# EAGLE design hauptplatine (EAGLE 4.09)
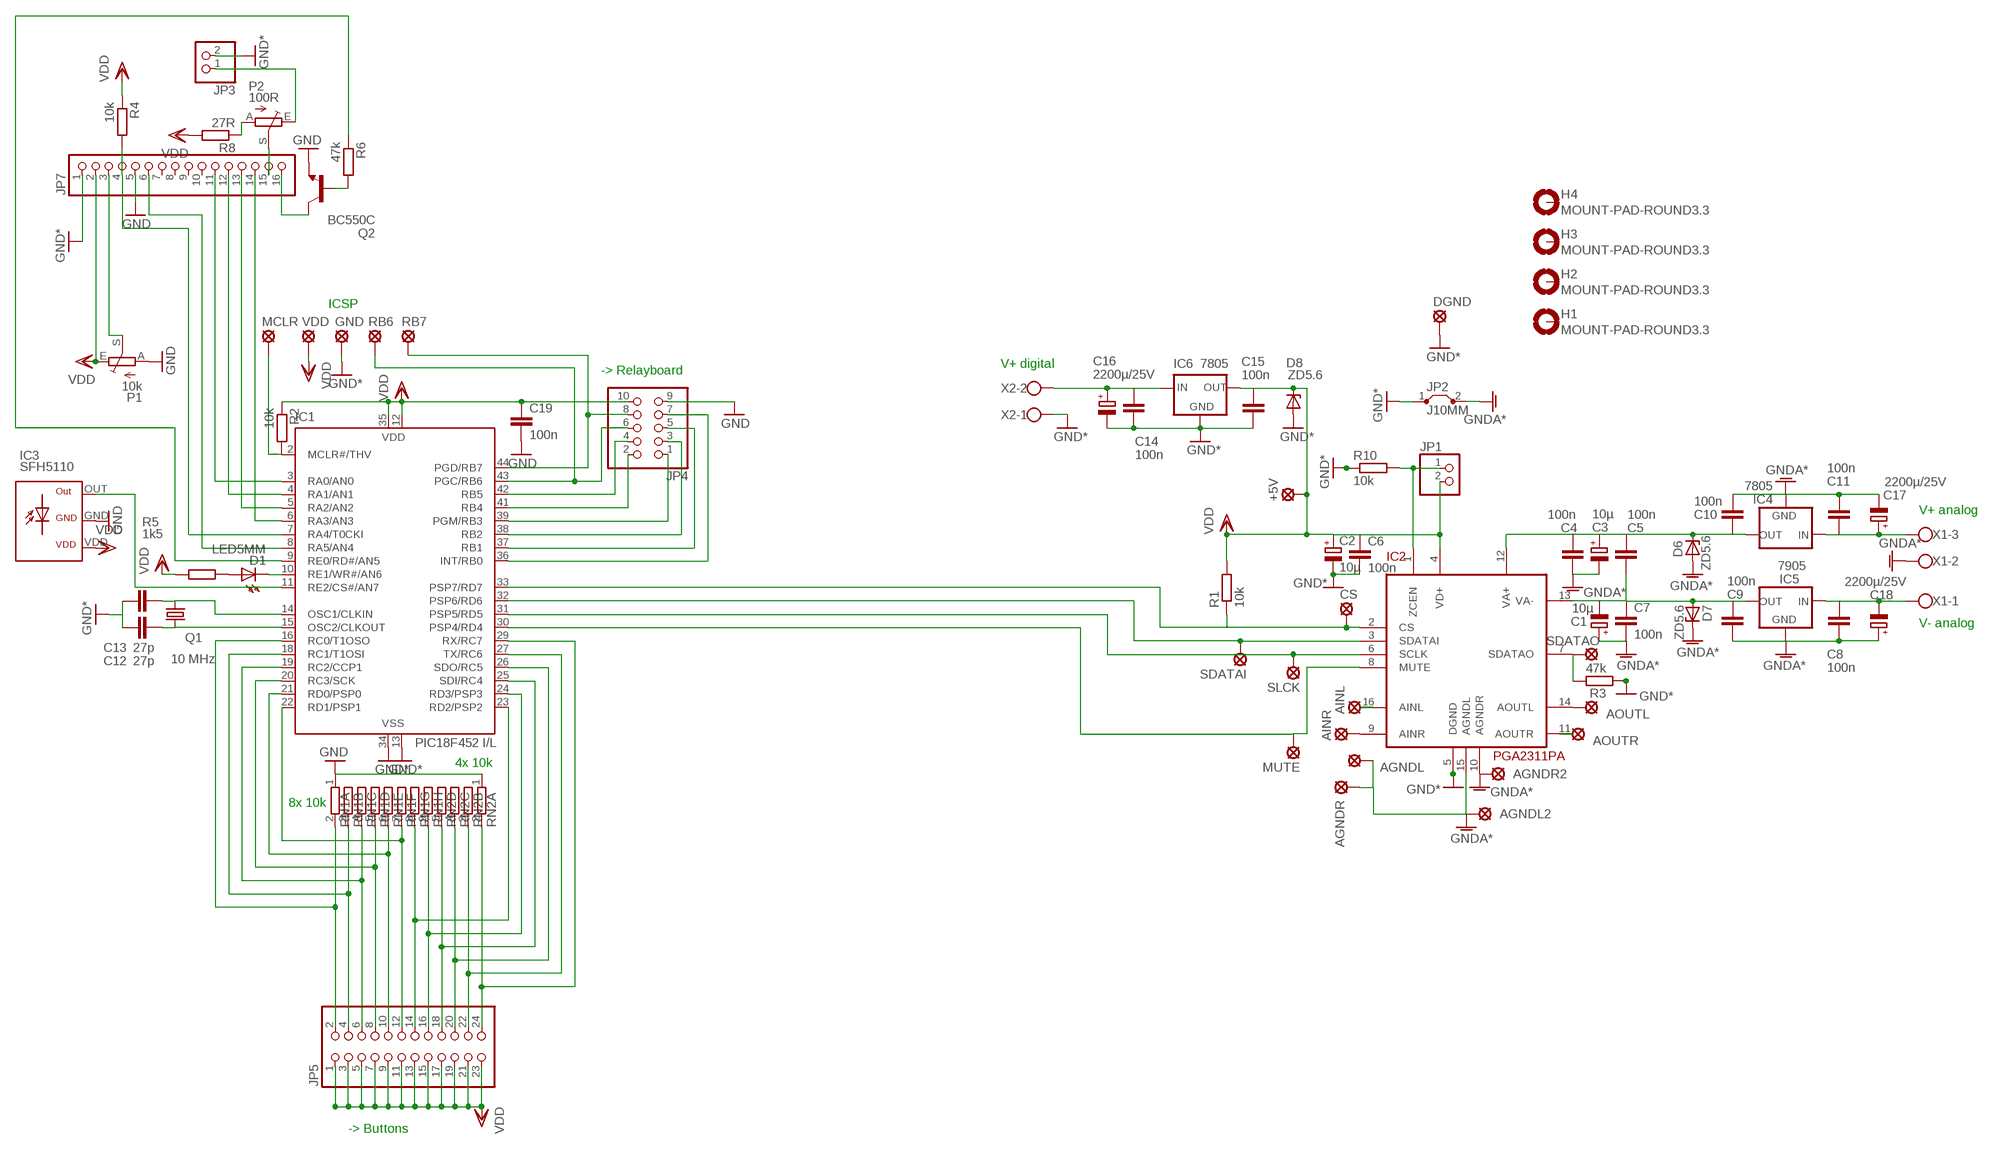
[diagram p0: schematic, sheet 1]

## Parts
+5V  LSP10  [LSP10]
AGNDL  LSP10  [LSP10]
AGNDL2  LSP10  [LSP10]
AGNDR  LSP10  [LSP10]
AGNDR2  LSP10  [LSP10]
AINL  LSP10  [LSP10]
AINR  LSP10  [LSP10]
AOUTL  LSP10  [LSP10]
AOUTR  LSP10  [LSP10]
C1  10µ  CPOL-EUE2-5  [E2-5]
C2  10µ  CPOL-EUE2-5  [E2-5]
C3  10µ  CPOL-EUE2-5  [E2-5]
C4  100n  C-EU050-025X075  [C050-025X075]
C5  100n  C-EU025-025X050  [C025-025X050]
C6  100n  C-EU025-025X050  [C025-025X050]
C7  100n  C-EU050-025X075  [C050-025X075]
C8  100n  C-EU050-025X075  [C050-025X075]
C9  100n  C-EU050-025X075  [C050-025X075]
C10  100n  C-EU050-025X075  [C050-025X075]
C11  100n  C-EU050-025X075  [C050-025X075]
C12  27p  C-EU025-024X044  [C025-024X044]
C13  27p  C-EU025-024X044  [C025-024X044]
C14  100n  C-EU050-025X075  [C050-025X075]
C15  100n  C-EU050-025X075  [C050-025X075]
C16  2200µ/25V  CPOL-EUE7.5-16  [E7,5-16]
C17  2200µ/25V  CPOL-EUE7.5-16  [E7,5-16]
C18  2200µ/25V  CPOL-EUE7.5-16  [E7,5-16]
C19  100n  C-EU025-025X050  [C025-025X050]
CS  LSP10  [LSP10]
D1  LED5MM  [LED5MM]
D6  ZD5.6  ZENER-DIODEZD-5  [ZDIO-5]
D7  ZD5.6  ZENER-DIODEZD-5  [ZDIO-5]
D8  ZD5.6  ZENER-DIODEZD-5  [ZDIO-5]
DGND  LSP10  [LSP10]
GND  LSP11  [LSP11]
H1  MOUNT-PAD-ROUND3.3  [3,3-PAD]
H2  MOUNT-PAD-ROUND3.3  [3,3-PAD]
H3  MOUNT-PAD-ROUND3.3  [3,3-PAD]
H4  MOUNT-PAD-ROUND3.3  [3,3-PAD]
IC1  PIC18F452 I/L  PIC16F87BEN  [PLCC44S_PIN]
IC2  PGA2311PA  CS3310-KP"  [DIP-16]
IC3  SFH5110  [SFH5110]
IC4  7805  78XXS  [78XXS]
IC5  7905  79XXS  [79XXS]
IC6  7805  78XXS  [78XXS]
JP1  PINHD-1X2  [1X02]
JP2  J10MM  [10]
JP3  PINHD-1X2  [1X02]
JP4  PINHD-2X5  [2X05]
JP5  PINHD-2X12  [2X12]
JP7  PINHD-1X16  [1X16]
MCLR  LSP11  [LSP11]
MUTE  LSP10  [LSP10]
P1  10k  TRIM_EU-LI10  [LI10]
P2  100R  TRIM_EU-LI10  [LI10]
Q1  10 MHz  HC18U-V  [HC18U-V]
Q2  BC550C  [TO92-EBC]
R1  10k  R-EU_0207/7  [0207/7]
R2  10k  R-EU_0207/10  [0207/10]
R3  47k  R-EU_0207/10  [0207/10]
R4  10k  R-EU_0207/7  [0207/7]
R5  1k5  R-EU_0207/2V  [0207/2V]
R6  47k  R-EU_0207/10  [0207/10]
R8  27R  R-EU_0207/7  [0207/7]
R10  10k  R-EU_0207/7  [0207/7]
RB6  LSP11  [LSP11]
RB7  LSP11  [LSP11]
RN1  GE08R  [SIL9]
RN2  GE04R  [SIL5]
SDATAI  LSP10  [LSP10]
SDATAO  LSP10  [LSP10]
SLCK  LSP10  [LSP10]
VDD  LSP11  [LSP11]
X1  W237-103  [W237-103]
X2  W237-102  [W237-102]

## Nets
AOUTR: AOUTR.MP IC2.11(AOUTR)
BUTTON1: IC1.16(RC0/T1OSO) JP5.2 RN1.2
BUTTON2: IC1.18(RC1/T1OSI) JP5.4 RN1.3
BUTTON3: IC1.19(RC2/CCP1) JP5.6 RN1.4
BUTTON4: IC1.20(RC3/SCK) JP5.8 RN1.5
BUTTON5: IC1.21(RD0/PSP0) JP5.10 RN1.6
BUTTON6: IC1.22(RD1/PSP1) JP5.12 RN1.7
BUTTON7: IC1.23(RD2/PSP2) JP5.14 RN1.8
BUTTON8: IC1.24(RD3/PSP3) JP5.16 RN1.9
CONT: JP7.3 P1.S
CS: CS.MP IC1.33(PSP7/RD7) IC2.2(CS) R1.1
D4: IC1.3(RA0/AN0) JP7.11
D5: IC1.4(RA1/AN1) JP7.12
D6: IC1.5(RA2/AN2) JP7.13
D7: IC1.6(RA3/AN3) JP7.14
D/I: IC1.7(RA4/T0CKI) JP7.4 R4.2
DOWN: IC1.25(SDI/RC4) JP5.18 RN2.5
E: IC1.8(RA5/AN4) JP7.6
E0: IC1.9(RE0/RD#/AN5) R6.1
GND: C2.- C6.1 C12.2 C13.2 C14.1 C15.1 C16.- C19.1 D8.A DGND.MP GND.MP IC1.13(VSS) IC1.34(VSS) IC2.5(DGND) IC3.GND IC6.GND JP2.1 JP3.2 JP4.9 JP7.1 JP7.5 P1.A Q2.E R3.1 R10.1 RN1.1 RN2.1 X2.1 ; supply symbol labelled GND*
GNDA: AGNDL2.MP AGNDL.MP AGNDR2.MP AGNDR.MP C1.+ C3.- C4.1 C7.1 C8.1 C9.1 C10.2 C11.2 C17.- C18.+ D6.A D7.C IC2.10(AGNDR) IC2.15(AGNDL) IC4.GND IC5.GND JP2.2 X1.2 ; supply symbol labelled GNDA*
IR_IN: IC1.11(RE2/CS#/AN7) IC3.OUT
LED: D1.K(C) IC1.10(RE1/WR#/AN6)
LEFT: IC1.27(TX/RC6) JP5.22 RN2.3
MUTE: IC1.30(PSP4/RD4) IC2.8(MUTE) MUTE.MP
N$1: AOUTL.MP IC2.14(AOUTL)
N$2: C8.2 C18.- IC5.IN X1.1
N$3: JP7.16 Q2.C
N$5: AINR.MP IC2.9(AINR)
N$6: AINL.MP IC2.16(AINL)
N$10: C11.1 C17.+ IC4.IN X1.3
N$11: IC1.2(MCLR#/THV) MCLR.MP R2.2
N$13: Q2.B R6.2
N$14: D1.A R5.2
N$17: IC2.1(ZCEN) JP1.1 R10.2
N$22: C14.2 C16.+ IC6.IN X2.2
N$25: P2.A R8.1
N$26: JP3.1 P2.E
N$27: JP7.15 P2.S
OSC1: C12.1 IC1.14(OSC1/CLKIN) Q1.2
OSC2: C13.1 IC1.15(OSC2/CLKOUT) Q1.1
RELAYS1: IC1.36(INT/RB0) JP4.7
RELAYS2: IC1.37(RB1) JP4.5
RELAYS3: IC1.38(RB2) JP4.3
RELAYS4: IC1.39(PGM/RB3) JP4.1
RELAYS5: IC1.41(RB4) JP4.2
RELAYS6: IC1.42(RB5) JP4.4
RELAYS7: IC1.43(PGC/RB6) JP4.6 RB6.MP
RELAYS8: IC1.44(PGD/RB7) JP4.8 RB7.MP
RIGHT: IC1.29(RX/RC7) JP5.24 RN2.2
SDATAI: IC1.32(PSP6/RD6) IC2.3(SDATAI) SDATAI.MP
SDATAO: IC2.7(SDATAO) R3.2 SDATAO.MP
SLCK: IC1.31(PSP5/RD5) IC2.6(SCLK) SLCK.MP
UP: IC1.26(SDO/RC5) JP5.20 RN2.4
VA+: C3.+ C4.2 C5.2 C10.1 D6.C IC2.12(VA+) IC4.OUT
VA-: C1.- C5.1 C7.2 C9.2 D7.A IC2.13(VA-) IC5.OUT
VDD: +5V.MP C2.+ C6.2 C15.2 C19.2 D8.C IC1.12(VDD) IC1.35(VDD) IC2.4(VD+) IC3.VDD IC6.OUT JP1.2 JP4.10 JP5.1 JP5.3 JP5.5 JP5.7 JP5.9 JP5.11 JP5.13 JP5.15 JP5.17 JP5.19 JP5.21 JP5.23 JP7.2 P1.E R1.2 R2.1 R4.1 R5.1 R8.2 VDD.MP
Unconnected: H1.B3,3(MOUNT) H2.B3,3(MOUNT) H3.B3,3(MOUNT) H4.B3,3(MOUNT) JP7.7 JP7.8 JP7.9 JP7.10

## Notes on the sheet
- ICSP
- V+ digital
- -> Relayboard
- V+ analog
- V- analog
- 4x 10k
- 8x 10k
- -> Buttons

## Library data of the parts
+5V AGNDL AGNDL2 AGNDR AGNDR2 AINL AINR AOUTL AOUTR CS DGND MUTE SDATAI SDATAO SLCK = solpad:LSP10: SOLDER PAD drill 1.0 mm, distributor Buerklin, 12H555
C1-C3 C16-C18 = rcl:CPOL-EU: POLARIZED CAPACITOR, European symbol
C4-C15 C19 = rcl:C-EU: CAPACITOR, European symbol
D1 = led:LED5MM: LED 5 mm, round
D6-D8 = diode:ZENER-DIODE: Z-Diode
GND MCLR RB6 RB7 VDD = solpad:LSP11: SOLDER PAD drill 1.1 mm
H1-H4 = holes:MOUNT-PAD-ROUND: MOUNTING PAD, round
IC1 = microchip:PIC16F87*: MICROCONTROLLER
IC2 = crystal-semi:CS3310-KP
IC3 = ben:SFH5110
IC4 IC6 = v-reg:78XXS: VOLTAGE REGULATOR
IC5 = v-reg:79XXS: VOLTAGE REGULATOR
JP1 JP3 = pinhead:PINHD-1X2: PIN HEADER
JP2 = jumper:J: Bridge
JP4 = pinhead:PINHD-2X5: PIN HEADER
JP5 = pinhead:PINHD-2X12: PIN HEADER
JP7 = pinhead:PINHD-1X16: PIN HEADER
P1 P2 = pot:TRIM_EU-: POTENTIOMETER
Q1 = crystal:HC18U-V: CRYSTAL
Q2 = transistor-npn:BC550*: NPN Transistor
R1-R6 R8 R10 = rcl:R-EU_: RESISTOR, European symbol
RN1 = resistor-sil:GE08R: SIL RESISTOR
RN2 = resistor-sil:GE04R: SIL RESISTOR
X1 = con-wago-500:W237-103: WAGO SCREW CLAMP
X2 = con-wago-500:W237-102: WAGO SCREW CLAMP

## Board
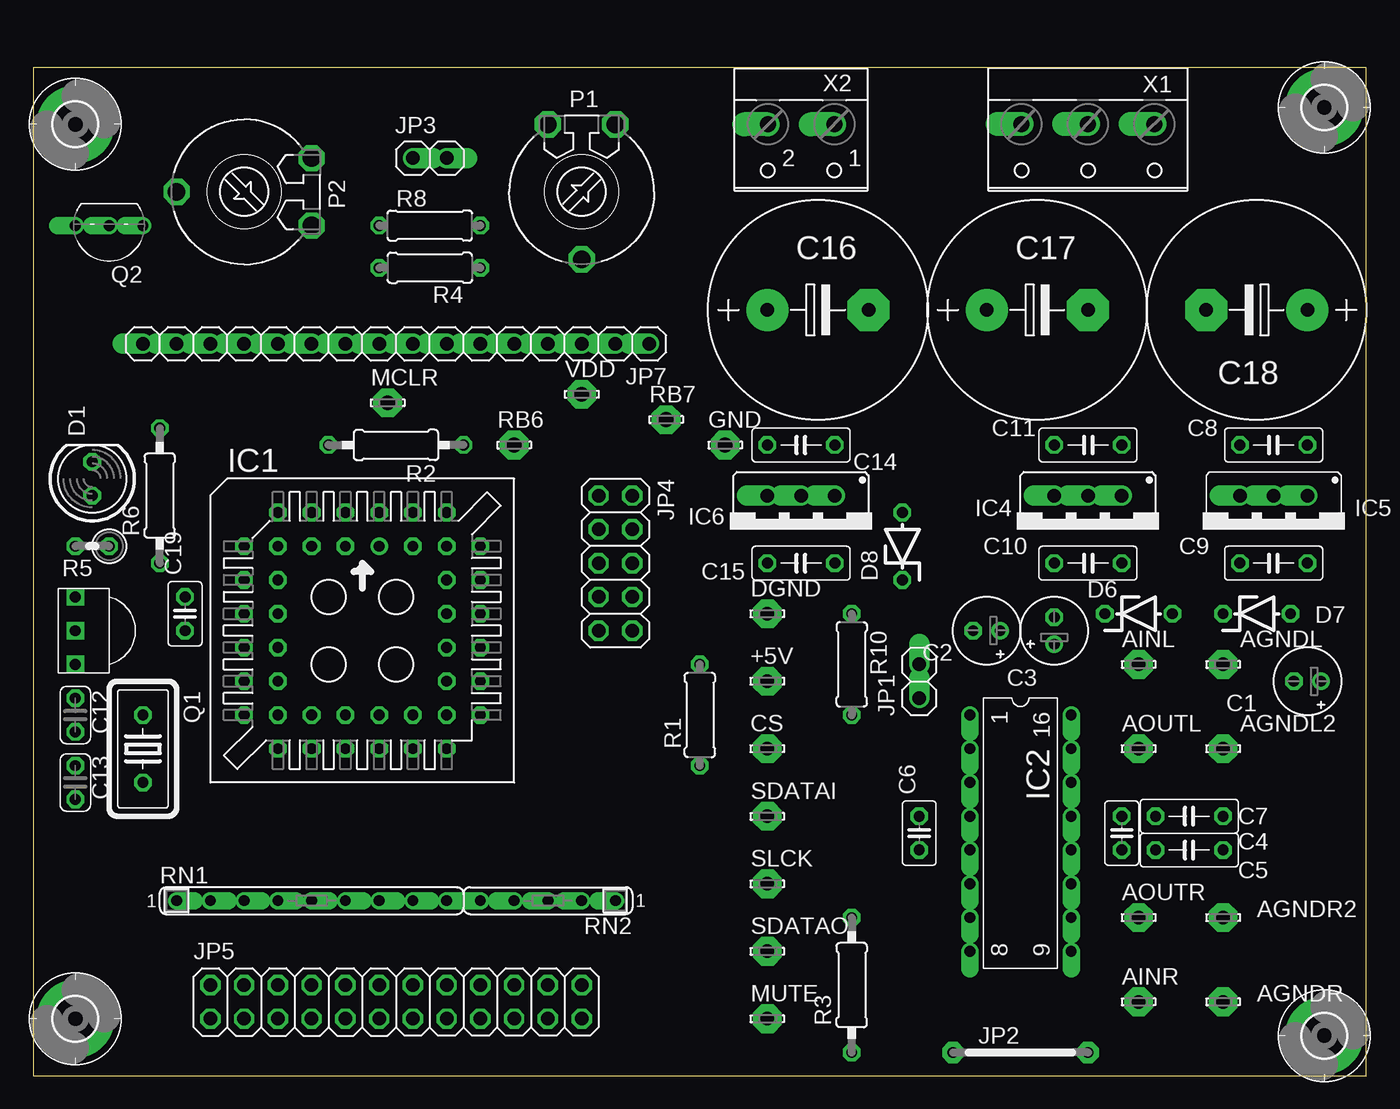
[diagram p1: board, top side]
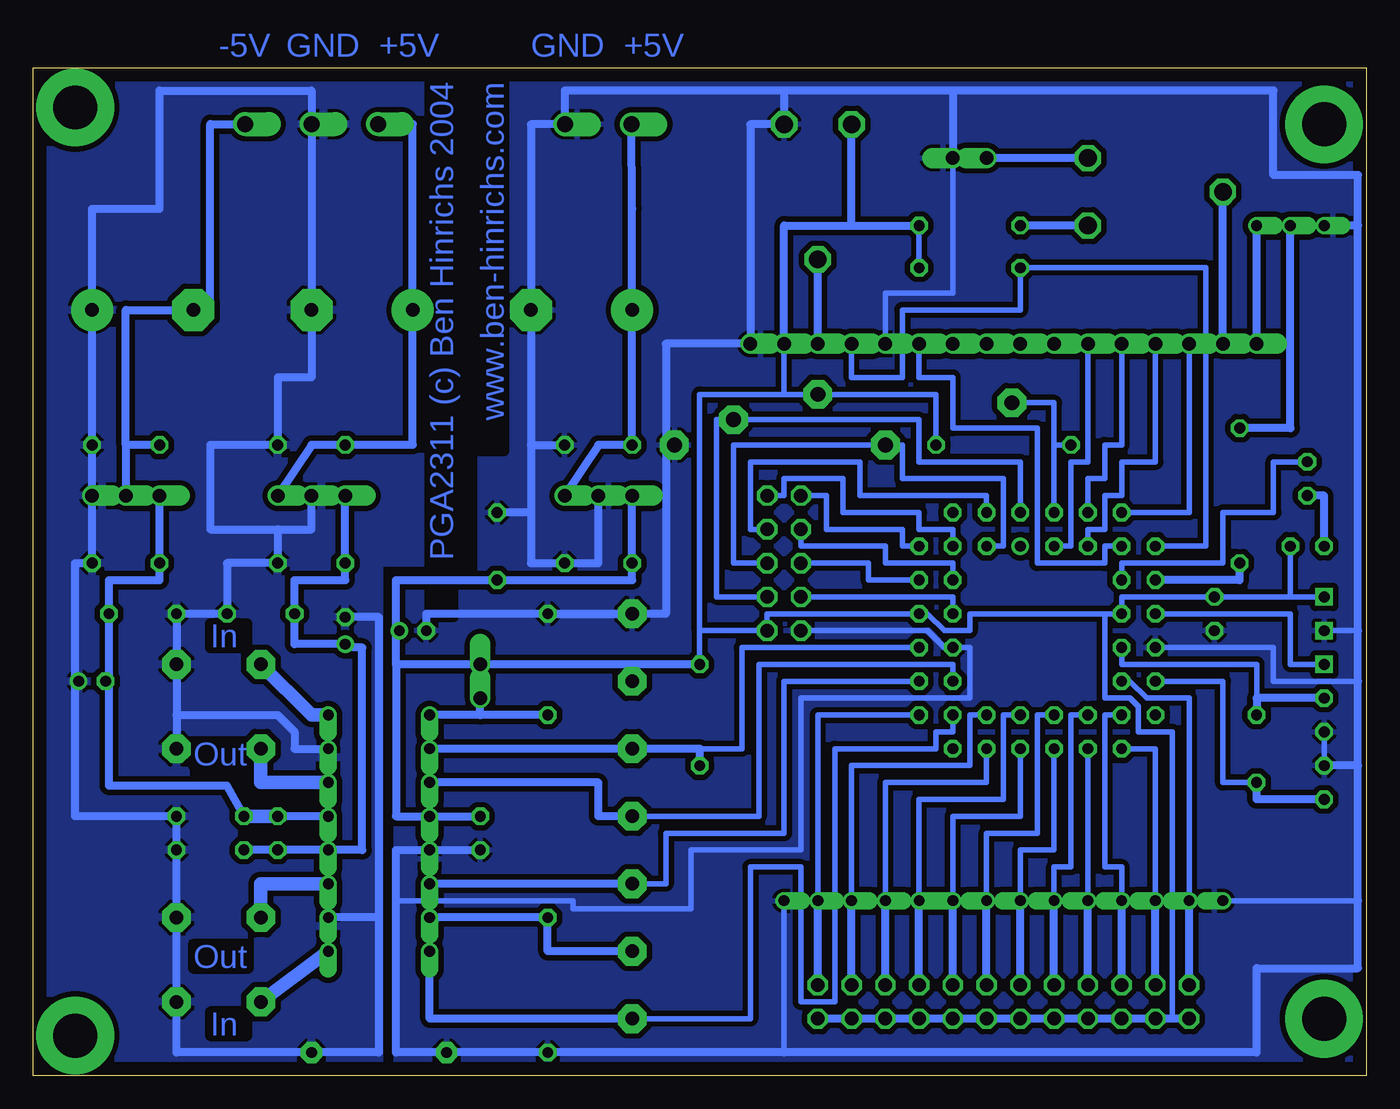
[diagram p2: board, bottom side, seen from below]

Size 100.31 x 75.87 mm. Coordinates in mm from the lower left corner, seen from the top.
Outline: 0,0 100.31,0 100.31,75.87 0,75.87 0,0
Copper layers used: Bottom

### Footprints (pad centres in the part's own frame; a part is rotated, then mirrored left to right if it is on the bottom)
LSP10 = drill 1.016 pad 2.159 octagon: MP 0,0
E2-5 = drill 0.813 pad 1.27 round: + -1.016,0 | drill 0.813 pad 1.27 octagon: - 1.016,0
C050-025X075 = drill 0.813 octagon: 1 -2.54,0; 2 2.54,0
C025-025X050 = drill 0.813 octagon: 1 -1.27,0; 2 1.27,0
C025-024X044 = drill 0.813 octagon: 1 -1.27,0; 2 1.27,0
E7,5-16 = drill 1.016 pad 3.15 round: + -3.81,0 | drill 1.016 pad 3.15 octagon: - 3.81,0
LED5MM = drill 0.813 octagon: A -1.27,0; K 1.27,0
ZDIO-5 = drill 0.813 octagon: A 2.54,0; C -2.54,0
LSP11 = drill 1.118 pad 2.159 octagon: MP 0,0
3,3-PAD = drill 3.3 pad 5.842 round: B3,3 0,0
PLCC44S_PIN = drill 0.813 round: 1 1.27,6.35 | drill 0.813 octagon: 2 -1.27,8.89; 3 -1.27,6.35; 4 -3.81,8.89; 5 -3.81,6.35; 6 -6.35,8.89; 7 -8.89,6.35; 8 -6.35,6.35; 9 -8.89,3.81; 10 -6.35,3.81; 11 -8.89,1.27; 12 -6.35,1.27; 13 -8.89,-1.27; 14 -6.35,-1.27; 15 -8.89,-3.81; 16 -6.35,-3.81; 17 -8.89,-6.35; 18 -6.35,-8.89; 19 -6.35,-6.35; 20 -3.81,-8.89; 21 -3.81,-6.35; 22 -1.27,-8.89; 23 -1.27,-6.35; 24 1.27,-8.89; 25 1.27,-6.35; 26 3.81,-8.89; 27 3.81,-6.35; 28 6.35,-8.89; 29 8.89,-6.35; 30 6.35,-6.35; 31 8.89,-3.81; 32 6.35,-3.81; 33 8.89,-1.27; 34 6.35,-1.27; 35 8.89,1.27; 36 6.35,1.27; 37 8.89,3.81; 38 6.35,3.81; 39 8.89,6.35; 40 6.35,8.89; 41 6.35,6.35; 42 3.81,8.89; 43 3.81,6.35; 44 1.27,8.89
DIP-16 = drill 0.813 offset: 1 -8.89,-3.81; 2 -6.35,-3.81; 3 -3.81,-3.81; 4 -1.27,-3.81; 5 1.27,-3.81; 6 3.81,-3.81; 7 6.35,-3.81; 8 8.89,-3.81; 9 8.89,3.81; 10 6.35,3.81; 11 3.81,3.81; 12 1.27,3.81; 13 -1.27,3.81; 14 -3.81,3.81; 15 -6.35,3.81; 16 -8.89,3.81
SFH5110 = drill 0.813 square: GND 0,1.27; OUT -2.54,1.27; VDD 2.54,1.27
78XXS = drill 1.016 offset: GND 0,-2.54; IN -2.54,-2.54; OUT 2.54,-2.54
79XXS = drill 1.016 offset: GND -2.54,-2.54; IN 0,-2.54; OUT 2.54,-2.54
1X02 = drill 1.016 offset: 1 -1.27,0; 2 1.27,0
10 = drill 0.813 pad 1.6 octagon: 1 -5.08,0; 2 5.08,0
2X05 = drill 1.016 octagon: 1 -5.08,-1.27; 2 -5.08,1.27; 3 -2.54,-1.27; 4 -2.54,1.27; 5 0,-1.27; 6 0,1.27; 7 2.54,-1.27; 8 2.54,1.27; 9 5.08,-1.27; 10 5.08,1.27
2X12 = drill 1.016 octagon: 1 -13.97,-1.27; 2 -13.97,1.27; 3 -11.43,-1.27; 4 -11.43,1.27; 5 -8.89,-1.27; 6 -8.89,1.27; 7 -6.35,-1.27; 8 -6.35,1.27; 9 -3.81,-1.27; 10 -3.81,1.27; 11 -1.27,-1.27; 12 -1.27,1.27; 13 1.27,-1.27; 14 1.27,1.27; 15 3.81,-1.27; 16 3.81,1.27; 17 6.35,-1.27; 18 6.35,1.27; 19 8.89,-1.27; 20 8.89,1.27; 21 11.43,-1.27; 22 11.43,1.27; 23 13.97,-1.27; 24 13.97,1.27
1X16 = drill 1.016 offset: 1 -19.05,0; 2 -16.51,0; 3 -13.97,0; 4 -11.43,0; 5 -8.89,0; 6 -6.35,0; 7 -3.81,0; 8 -1.27,0; 9 1.27,0; 10 3.81,0; 11 6.35,0; 12 8.89,0; 13 11.43,0; 14 13.97,0; 15 16.51,0; 16 19.05,0
LI10 = drill 1.321 octagon: A -2.54,-5.08; E 2.54,-5.08; S 0,5.08
HC18U-V = drill 0.813 octagon: 1 -2.54,0; 2 2.54,0
TO92-EBC = drill 0.813 offset: B 0,-1.27; C -2.54,-1.27; E 2.54,-1.27
0207/7 = drill 0.813 octagon: 1 -3.81,0; 2 3.81,0
0207/10 = drill 0.813 octagon: 1 -5.08,0; 2 5.08,0
0207/2V = drill 0.813 octagon: 1 -1.27,0; 2 1.27,0
SIL9 = drill 0.813 offset: 1 -10.16,0; 2 -7.62,0; 3 -5.08,0; 4 -2.54,0; 5 0,0; 6 2.54,0; 7 5.08,0; 8 7.62,0; 9 10.16,0
SIL5 = drill 0.813 offset: 1 -5.08,0; 2 -2.54,0; 3 0,0; 4 2.54,0; 5 5.08,0
W237-103 = drill 1.194 offset: 1 -5,-1.29; 2 0,-1.29; 3 5,-1.29
W237-102 = drill 1.194 offset: 1 -2.5,-1.27; 2 2.5,-1.27

### Placement (x,y rotation side)
+5V  55.24,29.68 0 top
AGNDL  89.53,30.95 0 top
AGNDL2  89.53,24.6 0 top
AGNDR  89.53,5.55 0 top
AGNDR2  89.53,11.9 0 top
AINL  83.18,30.95 0 top
AINR  83.18,5.55 0 top
AOUTL  83.18,24.6 0 top
AOUTR  83.18,11.9 0 top
C1  95.88,29.68 180 top
C2  71.75,33.49 180 top
C3  76.83,33.49 90 top
C4  86.99,16.98 180 top
C5  81.91,18.25 270 top
C6  66.67,18.25 90 top
C7  86.99,19.52 180 top
C8  93.34,47.46 180 top
C9  93.34,38.57 180 top
C10  79.37,38.57 0 top
C11  79.37,47.46 0 top
C12  3.17,27.14 270 top
C13  3.17,22.06 90 top
C14  57.78,47.46 180 top
C15  57.78,38.57 180 top
C16  59.05,57.62 0 top
C17  75.56,57.62 0 top
C18  92.07,57.62 180 top
C19  11.43,34.76 90 top
CS  55.24,24.6 0 top
D1  4.44,44.92 90 top
D6  83.18,34.76 0 top
D7  92.07,34.76 0 top
D8  65.4,39.84 90 top
DGND  55.24,34.76 0 top
GND  52.07,47.46 0 top
H1  3.17,71.59 0 top
H2  3.17,4.28 0 top
H3  97.15,3.01 0 top
H4  97.15,72.86 0 top
IC1  24.76,33.49 0 top
IC2  74.29,18.25 270 top
IC3  4.44,33.49 90 top
IC4  79.37,41.11 180 top
IC5  93.34,41.11 180 top
IC6  57.78,41.11 180 top
JP1  66.67,29.68 90 top
JP2  74.29,1.74 0 top
JP3  29.84,69.05 0 top
JP4  43.81,38.57 270 top
JP5  27.3,5.55 0 top
JP7  27.3,55.08 180 top
MCLR  26.66,50.63 0 top
MUTE  55.24,4.28 0 top
P1  41.27,66.51 180 top
P2  15.87,66.51 90 top
Q1  8.25,24.6 90 top
Q2  5.71,62.7 180 top
R1  50.16,27.14 90 top
R2  27.3,47.46 180 top
R3  61.59,6.82 90 top
R4  29.84,60.8 180 top
R5  4.44,39.84 180 top
R6  9.52,43.65 90 top
R8  29.84,63.97 0 top
R10  61.59,30.95 270 top
RB6  36.19,47.46 0 top
RB7  47.62,49.37 0 top
RN1  20.95,13.17 0 top
RN2  38.73,13.17 180 top
SDATAI  55.24,19.52 0 top
SDATAO  55.24,9.36 0 top
SLCK  55.24,14.44 0 top
VDD  41.27,51.27 0 top
X1  79.37,70.32 180 top
X2  57.78,70.32 180 top

### Tracks (layer width: path | path; a pad name or v marks a point on that pad's centre or on a via)
AOUTR
  Bottom 1.016: IC2.11 83.18,14.44 AOUTR.MP
BUTTON1
  Bottom 0.406: RN1.2 13.33,28.41 16.5,28.41 17.77,29.68 IC1.16
  Bottom 0.61: JP5.2 RN1.2
BUTTON2
  Bottom 0.406: IC1.18 15.87,24.6 RN1.3
  Bottom 0.61: JP5.4 RN1.3
BUTTON3
  Bottom 0.406: IC1.19 19.68,27.14 19.68,15.71 18.41,15.71 RN1.4
  Bottom 0.61: JP5.6 RN1.4
BUTTON4
  Bottom 0.406: RN1.5 IC1.20
  Bottom 0.61: JP5.8 RN1.5
BUTTON5
  Bottom 0.406: IC1.21 22.22,27.14 22.22,15.71 23.49,15.71 RN1.6
  Bottom 0.61: JP5.10 RN1.6
BUTTON6
  Bottom 0.406: IC1.22 23.49,16.98 26.03,16.98 RN1.7
  Bottom 0.61: JP5.12 RN1.7
BUTTON7
  Bottom 0.406: IC1.23 24.76,27.14 24.76,18.25 28.57,18.25 RN1.8
  Bottom 0.61: JP5.14 RN1.8
BUTTON8
  Bottom 0.406: IC1.24 26.03,19.52 31.11,19.52 RN1.9
  Bottom 0.61: JP5.16 RN1.9
CONT
  Bottom 0.61: JP7.3 P1.S
CS
  Bottom 0.406: 50.16,24.6 46.98,24.6 46.98,32.22 IC1.33
  Bottom 0.61: CS.MP 50.16,24.6 R1.1 | CS.MP IC2.2 CS.MP
D4
  Bottom 0.406: IC1.3 22.22,39.84 22.22,46.19 20.95,46.19 JP7.11
D5
  Bottom 0.406: IC1.4 20.95,44.92 19.68,44.92 19.68,47.46 18.41,47.46 JP7.12
D6
  Bottom 0.406: IC1.5 20.95,41.11 19.68,41.11 19.68,43.65 18.41,43.65 18.41,46.19 15.87,46.19 JP7.13
D7
  Bottom 0.406: IC1.6 13.33,42.38 JP7.14
D/I
  Bottom 0.406: JP7.4 38.73,52.54 34.92,52.54 34.92,57.62 26.03,57.62 R4.2 12.06,60.8 12.06,39.84 IC1.7
DOWN
  Bottom 0.406: IC1.25 27.3,27.14 27.3,20.79 33.65,20.79 RN2.5
  Bottom 0.61: JP5.18 RN2.5
E
  Bottom 0.406: IC1.8 19.68,39.84 19.68,38.57 24.76,38.57 24.76,48.73 31.11,48.73 31.11,52.54 33.65,52.54 JP7.6
E0
  Bottom 0.61: R6.1 9.52,37.3 IC1.9
GND
  Bottom 0.406: C13.2 C12.2 | 0.63,33.49 IC3.GND | IC1.13 6.98,32.22 6.98,29.68 0.63,29.68 | 0.63,13.17 RN1.1 | 43.81,1.74 RN2.1 | JP4.9 33.02,33.49 31.74,32.22 IC1.34 29.84,32.22 29.84,28.41 42.54,28.41 42.54,16.98 50.8,16.98 50.8,12.54 59.69,12.54 59.69,13.17 73.02,13.17 | JP7.5 36.19,58.89 31.11,58.89 JP3.2 | 52.7,47.46 GND.MP
  Bottom 0.61: 31.11,74.13 JP3.2 | 31.11,74.13 43.81,74.13 | R10.1 52.7,34.76 52.7,47.46 52.7,55.08 JP7.1 46.35,71.59 P1.A 43.81,74.13 | R10.1 DGND.MP R10.1 | C6.1 IC2.5 73.02,16.98 73.02,13.17 73.02,1.74 JP2.1 | 0.63,23.33 0.63,13.17 0.63,8.09 8.25,8.09 8.25,1.74 43.81,1.74 R3.1 | 0.63,23.33 0.63,29.68 0.63,33.49 0.63,63.97 | 0.63,63.97 0.63,67.78 6.98,67.78 6.98,74.13 31.11,74.13 | IC6.GND 57.78,38.57 C15.1 62.86,38.57 62.86,42.38 | 43.81,74.13 60.32,74.13 60.32,71.59 X2.1 62.86,71.59 C16.- 62.86,47.46 | 62.86,47.46 C14.1 | R10.1 70.73,34.76 C2.- | 62.86,42.38 D8.A | 62.86,47.46 62.86,42.38 | R3.1 JP2.1 | R3.1 JP2.1 | 0.63,23.33 C13.2 | 0.63,63.97 Q2.E
  pour Bottom (isolate 0.406): 66.67,75.4 66.67,37.3 73.02,37.3 73.02,0.47 0.63,0.47 0.63,75.4
GNDA
  Bottom 0.61: 81.91,41.11 86.99,41.11 86.99,47.46 C11.2 81.91,52.54 79.37,52.54 C17.- 79.37,74.13 90.8,74.13 90.8,65.24 95.88,65.24 C8.1 IC5.GND C9.1 97.15,38.57 97.15,29.68 | 89.53,27.14 AGNDL2.MP | 89.53,27.14 AGNDL.MP D7.C D6.A 85.72,38.57 C10.2 81.91,41.11 | IC4.GND 79.37,41.11 81.91,41.11 | C3.- 74.29,34.51 74.29,11.9 | 74.29,11.9 74.29,1.74 JP2.2 89.53,1.74 AGNDR.MP AGNDR2.MP C4.1 C7.1 | 74.29,11.9 IC2.10 | IC2.15 80.64,24.6 80.64,25.87 81.91,27.14 89.53,27.14 | C7.1 94.61,19.52 | C7.1 97.15,19.52 97.15,29.68 | 97.15,29.68 C1.+
  pour Bottom (isolate 0.406): 99.69,75.4 67.94,75.4 67.94,38.57 74.29,38.57 74.29,0.47 99.69,0.47
IR_IN
  Bottom 0.406: IC1.11 5.71,34.76 5.71,30.95 IC3.OUT
LED
  Bottom 0.406: IC1.10 18.41,38.57 10.79,38.57 10.79,42.38 6.98,42.38 6.98,46.19 D1.K
LEFT
  Bottom 0.406: IC1.27 29.84,27.14 29.84,23.33 38.73,23.33 RN2.3
  Bottom 0.61: JP5.22 RN2.3
MUTE
  Bottom 0.406: MUTE.MP 46.35,4.28 46.35,15.71 42.54,15.71 42.54,5.55 40,5.55 40,24.6 32.38,24.6 32.38,25.87 31.11,25.87 IC1.30
  Bottom 0.61: IC2.8 70.48,4.28 MUTE.MP
N$1
  Bottom 1.016: IC2.14 83.18,22.06 AOUTL.MP
N$2
  Bottom 0.61: 93.34,47.46 93.34,57.62 C18.- 88.26,57.64 86.99,57.64 86.99,71.61 X1.1 | 93.34,47.46 IC5.IN | C8.2 93.34,47.46
N$3
  Bottom 0.61: JP7.16 Q2.C
N$5
  Bottom 1.016: IC2.9 AINR.MP
N$6
  Bottom 1.016: IC2.16 79.37,27.14 AINL.MP
N$10
  Bottom 0.61: IC4.IN 79.37,47.46 C11.1 71.75,47.46 C17.+ 71.75,71.61 X1.3
N$11
  Bottom 0.406: IC1.2 23.49,47.46 | 23.49,47.46 R2.2 | MCLR.MP 23.49,50.63 23.49,47.46
N$13
  Bottom 0.61: R6.2 5.71,48.73 Q2.B
N$14
  Bottom 0.61: R5.2 3.17,43.65 D1.A
N$17
  Bottom 0.61: R10.2 66.67,27.14 | 66.67,27.14 IC2.1 | 66.67,27.14 JP1.1
N$22
  Bottom 0.61: X2.2 55.24,65.24 C16.+ C14.2 57.78,47.46 IC6.IN
N$25
  Bottom 0.61: P2.A R8.1
N$26
  Bottom 0.61: P2.E JP3.1
N$27
  Bottom 0.61: JP7.15 P2.S
OSC1
  Bottom 0.406: 8.25,28.41 8.25,30.95 18.41,30.95 IC1.14
  Bottom 0.61: Q1.2 8.25,28.41 C12.1
OSC2
  Bottom 0.406: IC1.15 10.79,29.68 10.79,22.06 Q1.1
  Bottom 0.61: Q1.1 8.25,20.79 C13.1
RELAYS1
  Bottom 0.406: IC1.36 31.11,36.03 JP4.7
RELAYS2
  Bottom 0.406: IC1.37 37.46,37.3 37.46,38.57 JP4.5
RELAYS3
  Bottom 0.406: IC1.38 31.11,38.57 36.19,38.57 36.19,39.84 42.54,39.84 JP4.3
RELAYS4
  Bottom 0.406: IC1.39 34.92,39.84 34.92,41.11 40.64,41.11 40.64,43.65 JP4.1
RELAYS5
  Bottom 0.406: JP4.2 43.81,43.65 43.81,44.92 39.37,44.92 39.37,42.38 33.65,42.38 33.65,41.11 31.11,41.11 IC1.41
RELAYS6
  Bottom 0.406: JP4.4 46.35,41.11 46.35,46.19 38.1,46.19 38.1,43.65 28.57,43.65 IC1.42
RELAYS7
  Bottom 0.406: JP4.6 47.62,38.57 47.62,47.46 RB6.MP 34.92,47.46 34.92,44.92 27.3,44.92 27.3,39.84 IC1.43
RELAYS8
  Bottom 0.406: JP4.8 48.89,36.03 48.89,49.37 RB7.MP 33.65,49.37 33.65,46.19 26.03,46.19 IC1.44
RIGHT
  Bottom 0.406: RN2.2 41.27,27.14 IC1.29
  Bottom 0.61: JP5.24 RN2.2
SDATAI
  Bottom 0.406: SDATAI.MP 45.72,19.52 45.72,30.95 31.11,30.95 IC1.32
  Bottom 0.61: IC2.3 57.78,22.06 57.78,19.52 SDATAI.MP
SDATAO
  Bottom 0.61: SDATAO.MP 61.59,9.36 R3.2 IC2.7
SLCK
  Bottom 0.406: IC1.31 43.81,29.68 43.81,19.52 43.81,18.25 52.7,18.25 52.7,14.44 SLCK.MP
  Bottom 0.61: SLCK.MP IC2.6
UP
  Bottom 0.406: IC1.26 28.57,22.06 36.19,22.06 RN2.4
  Bottom 0.61: JP5.20 RN2.4
VA+
  Bottom 0.61: C4.2 C5.2 IC2.12 75.56,16.98 75.56,32.22 76.83,32.22 C3.+ 80.64,32.47 | IC4.OUT C10.1 76.83,37.3 80.64,37.3 80.64,32.47 | 80.64,32.47 D6.C
VA-
  Bottom 0.61: IC2.13 C5.1 | IC5.OUT C9.2 90.8,37.3 94.61,37.3 D7.A 94.61,29.68 | C7.2 85.72,21.81 94.61,21.81 94.61,29.68 | 94.61,29.68 C1.-
  Bottom 1.016: C5.1 C7.2
VDD
  Bottom 0.406: 5.71,36.03 R5.1 | 5.71,36.03 IC3.VDD | 43.81,51.27 JP7.2 | 43.81,51.27 50.16,51.27 50.16,33.49 | 50.16,33.49 JP4.10 45.08,34.76 IC1.35 33.02,34.76 31.74,33.49 29.84,33.49 29.84,34.76 19.68,34.76 | 50.16,33.49 R1.2 | 19.68,34.76 IC1.12 18.41,36.03 C19.2 5.71,36.03 | 19.68,34.76 19.68,28.41 17.77,28.41 17.14,27.77 17.14,25.87 14.6,25.87 14.6,4.28 | R2.1 32.38,51.27 VDD.MP 43.81,51.27 | R8.2 R4.1
  Bottom 0.61: 73.02,30.95 73.02,19.52 IC2.4 C6.2 | R1.2 55.24,30.95 | 55.24,30.95 JP1.2 73.02,30.95 | 73.02,33.49 C2.+ | 73.02,30.95 73.02,33.49 | IC6.OUT C15.2 55.24,37.3 D8.C 73.02,37.3 73.02,33.49 | 55.24,30.95 +5V.MP | 38.73,63.97 43.81,63.97 JP7.2 | 38.73,63.97 P1.E | 38.73,63.97 R8.2 | JP5.1 14.6,4.28 JP5.3 JP5.5 JP5.7 JP5.9 JP5.11 JP5.13 JP5.15 JP5.17 JP5.19 JP5.21 JP5.23

### Text on the board
Bottom: +5V | GND | +5V | GND | -5V | www.ben-hinrichs.com | PGA2311 (c) Ben Hinrichs 2004 | In | Out | Out | In